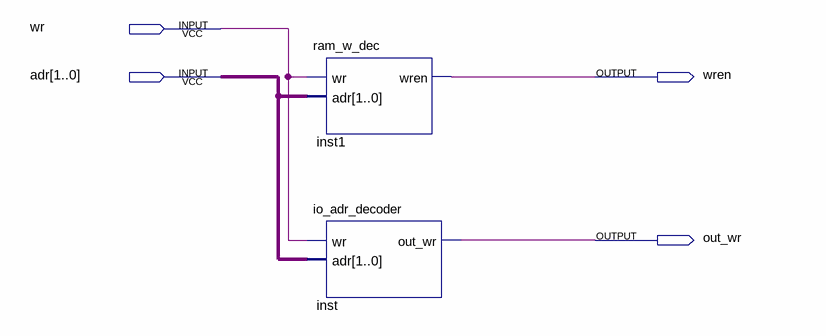
[diagram p0: schematic sheet]
// Quartus schematic adr_decoder.bdf as structural Verilog: 2 symbols, 4 pins
module adr_decoder (
  input  wr,
  input  [1:0] adr,
  output wren,
  output out_wr
);

  ram_w_dec inst1 (.wr(wr), .adr(adr), .wren(wren));
  io_adr_decoder inst (.wr(wr), .adr(adr), .out_wr(out_wr));
endmodule
